# Altium schematic sheet Sheet1.SchDoc
size A4
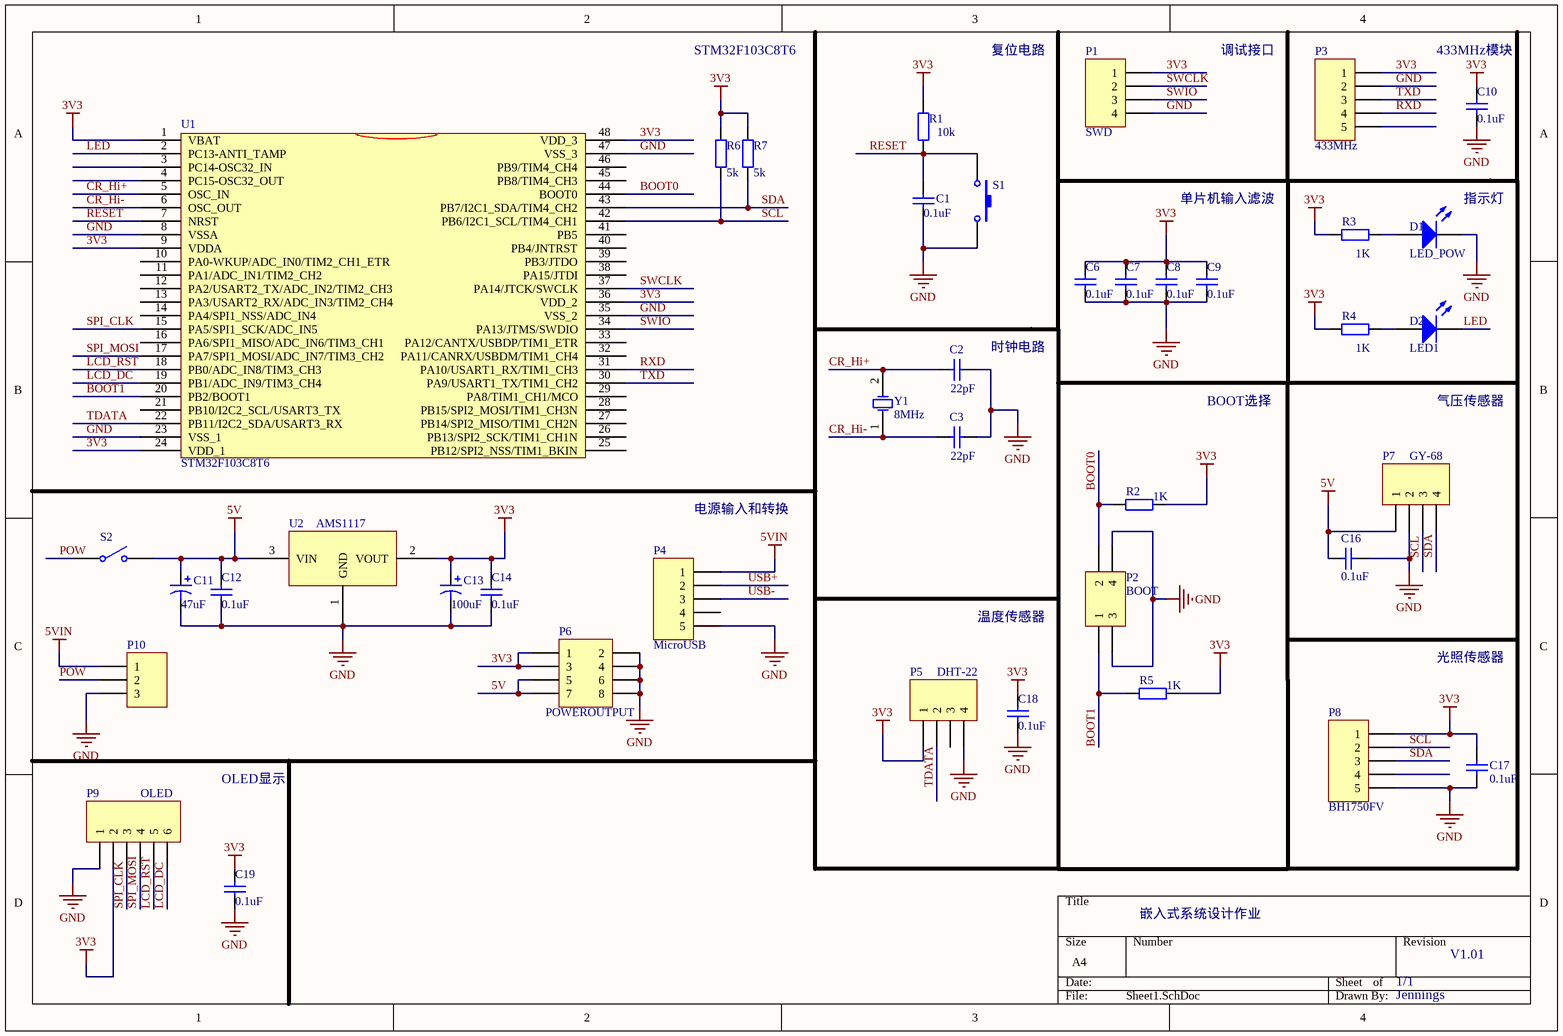
[diagram p0: Sheet1.SchDoc]

## Parts
C1  value 0.1uF  [0402]  (hidden comment: Cap)
C2  value 22pF  [0603-1]  (hidden comment: Cap)
C3  value 22pF  [0603-1]  (hidden comment: Cap)
C6  value 0.1uF  [0402]  (hidden comment: Cap)
C7  value 0.1uF  [0402]  (hidden comment: Cap)
C8  value 0.1uF  [0402]  (hidden comment: Cap)
C9  value 0.1uF  [0402]  (hidden comment: Cap)
C10  value 0.1uF  [0402]  (hidden comment: Cap)
C11  value 47uF  [CAP-7343]  (hidden comment: Cap Pol1)
C12  value 0.1uF  [0402]  (hidden comment: Cap)
C13  value 100uF  [CAP-6032]  (hidden comment: Cap Pol1)
C14  value 0.1uF  [0402]  (hidden comment: Cap)
C16  value 0.1uF  [0402]  (hidden comment: Cap)
C17  value 0.1uF  [0402]  (hidden comment: Cap)
C18  value 0.1uF  [0402]  (hidden comment: Cap)
C19  value 0.1uF  [0402]  (hidden comment: Cap)
D1  LED_POW  [0402]
D2  LED1  [0402]
P1  SWD  [HDR1X4]
P2  BOOT  [HDR2X2]
P3  433MHz  [HDR1X5]
P4  MicroUSB  [Micro_USB]
P5  DHT-22  [DHT22]
P6  POWEROUTPUT  [HDR2X4]
P7  GY-68  [BMP180MD]
P8  BH1750FV  [GY-30MD]
P9  OLED  [OLED0.96]
P10  Header 3  [HDR1X3]  (value not drawn)
R1  value 10k  [0603-1]  (hidden comment: Res2)
R2  value 1K  [0402]  (hidden comment: Res2)
R3  value 1K  [0402]  (hidden comment: Res2)
R4  value 1K  [0402]  (hidden comment: Res2)
R5  value 1K  [0402]  (hidden comment: Res2)
R6  value 5k  [0603-1]  (hidden comment: Res2)
R7  value 5k  [0603-1]  (hidden comment: Res2)
S1  SW-PB  [SW_PB4_A1]  (value not drawn)
S2  SW_POWER  [SW_Small]  (value not drawn)
U1  STM32F103C8T6  [LQFP48S]
U2  AMS1117  [SOT-223]
Y1  8MHz  [XTAL-8M]

## Nets
3V3: C6.2 C7.2 C8.2 C9.2 C10.2 C13.1 C14.2 C17.1 C18.2 C19.2 P1.1 P3.1 P5.1 P6.1 P6.3 P8.1 P9.2 R1.2 R2.2 R3.1 R4.1 R5.2 R6.2 R7.2 U1.1(VBAT) U1.9(VDDA) U1.24(VDD_1) U1.36(VDD_2) U1.48(VDD_3) U2.2(VOUT)
5V: C11.1 C12.2 C16.2 P6.5 P6.7 P7.1 S2.2(NO) U2.3(VIN)
5VIN: P4.1 P10.1
GND: C1.1 C2.2 C3.2 C6.1 C7.1 C8.1 C9.1 C10.1 C11.2 C12.1 C13.2 C14.1 C16.1 C17.2 C18.1 C19.1 D1.2(K) P1.4 P2.3 P2.4 P3.2 P4.5 P5.4 P6.2 P6.4 P6.6 P6.8 P7.2 P8.5 P9.1 P10.3 S1.2 U1.8(VSSA) U1.23(VSS_1) U1.35(VSS_2) U1.47(VSS_3) U2.1(GND)
BOOT0: P2.2 R2.1 U1.44(BOOT0)
BOOT1: P2.1 R5.1 U1.20(PB2/BOOT1)
CR_Hi+: C2.1 U1.5(OSC_IN) Y1.2(OSC2)
CR_Hi-: C3.1 U1.6(OSC_OUT) Y1.1(OSC1)
LCD_DC: P9.6 U1.19(PB1/ADC_IN9/TIM3_CH4)
LCD_RST: P9.5 U1.18(PB0/ADC_IN8/TIM3_CH3)
LED: D2.2(K) U1.2(PC13-ANTI_TAMP)
POW: P10.2 S2.1(COMMON)
RESET: C1.2 R1.1 S1.1 U1.7(NRST)
RXD: P3.4 U1.31(PA10/USART1_RX/TIM1_CH3)
SCL: P7.3 P8.2 R6.1 U1.42(PB6/I2C1_SCL/TIM4_CH1)
SDA: P7.4 P8.3 R7.1 U1.43(PB7/I2C1_SDA/TIM4_CH2)
SPI_CLK: P9.3 U1.15(PA5/SPI1_SCK/ADC_IN5)
SPI_MOSI: P9.4 U1.17(PA7/SPI1_MOSI/ADC_IN7/TIM3_CH2)
SWCLK: P1.2 U1.37(PA14/JTCK/SWCLK)
SWIO: P1.3 U1.34(PA13/JTMS/SWDIO)
TDATA: P5.2 U1.22(PB11/I2C2_SDA/USART3_RX)
TXD: P3.3 U1.30(PA9/USART1_TX/TIM1_CH2)
USB+: P4.2
USB-: P4.3
NetD1_1: D1.1(A) R3.2
NetD2_1: D2.1(A) R4.2

Not connected (* = marked no-connect by the designer): P3 5; P4 4; P5 3; P8 4; U1 3(PC14-OSC32_IN) 4(PC15-OSC32_OUT) 10(PA0-WKUP/ADC_IN0/TIM2_CH1_ETR) 11(PA1/ADC_IN1/TIM2_CH2) 12(PA2/USART2_TX/ADC_IN2/TIM2_CH3) 13(PA3/USART2_RX/ADC_IN3/TIM2_CH4) 14(PA4/SPI1_NSS/ADC_IN4) 16(PA6/SPI1_MISO/ADC_IN6/TIM3_CH1) 21(PB10/I2C2_SCL/USART3_TX) 25(PB12/SPI2_NSS/TIM1_BKIN) 26(PB13/SPI2_SCK/TIM1_CH1N) 27(PB14/SPI2_MISO/TIM1_CH2N) 28(PB15/SPI2_MOSI/TIM1_CH3N) 29(PA8/TIM1_CH1/MCO) 32(PA11/CANRX/USBDM/TIM1_CH4) 33(PA12/CANTX/USBDP/TIM1_ETR) 38(PA15/JTDI) 39(PB3/JTDO) 40(PB4/JNTRST) 41(PB5) 45(PB8/TIM4_CH3) 46(PB9/TIM4_CH4)

## Notes on the sheet
- STM32F103C8T6
- 复位电路
- 调试接口
- (near C10) 433MHz模块
- 单片机输入滤波
- (near D1) 指示灯
- (near C2) 时钟电路
- BOOT选择
- 气压传感器
- 电源输入和转换
- 温度传感器
- 光照传感器
- OLED显示
- 嵌入式系统设计作业
- 1/1
- V1.01
- Jennings

## Library data of the parts
C1-C3 C6-C10 C12 C14 C16-C19 = Cap: Capacitor; Published: 8-Jun-2000; LatestRevisionDate: 17-Jul-2002; LatestRevisionNote: Re-released for DXP Platform.; PackageReference: RAD-0.3; Publisher: Altium Limited
C11 C13 = Cap Pol1: Polarized Capacitor (Radial); Published: 8-Jun-2000; LatestRevisionDate: 17-Jul-2002; LatestRevisionNote: Re-released for DXP Platform.; PackageReference: RB7.6-15; Publisher: Altium Limited
D1 D2 = LED2: Typical RED, GREEN, YELLOW, AMBER GaAs LED; Published: 8-Jun-2000; LatestRevisionDate: 17-Jul-2002; LatestRevisionNote: Re-released for DXP Platform.; PackageDocument: Feb-2002; PackageReference: 3.2X1.6X1.1; Publisher: Altium Limited
P1 P5 P7 = Header 4: Header, 4-Pin; LatestRevisionDate: 17-Jul-2002; LatestRevisionNote: Re-released for DXP Platform.; Publisher: Altium Limited
P2 = Header 2X2: Header, 2-Pin, Dual row; LatestRevisionDate: 17-Jul-2002; LatestRevisionNote: Re-released for DXP Platform.; Publisher: Altium Limited
P3 P4 P8 = Header 5: Header, 5-Pin; LatestRevisionDate: 17-Jul-2002; LatestRevisionNote: Re-released for DXP Platform.; Publisher: Altium Limited
P6 = Header 4X2: Header, 4-Pin, Dual row; LatestRevisionDate: 17-Jul-2002; LatestRevisionNote: Re-released for DXP Platform.; Publisher: Altium Limited
P9 = Header 6: Header, 6-Pin; LatestRevisionDate: 17-Jul-2002; LatestRevisionNote: Re-released for DXP Platform.; Publisher: Altium Limited
P10 = Header 3: Header, 3-Pin; LatestRevisionDate: 17-Jul-2002; LatestRevisionNote: Re-released for DXP Platform.; Publisher: Altium Limited
R1-R7 = Res2: Resistor; Published: 8-Jun-2000; LatestRevisionDate: 17-Jul-2002; LatestRevisionNote: Re-released for DXP Platform.; PackageReference: AXIAL-0.4; Publisher: Altium Limited
S1 = SW-PB: Switch; Published: 24-Mar-1999; LatestRevisionDate: 17-Jul-2002; LatestRevisionNote: Re-released for DXP Platform.; PackageReference: SPST-2; Publisher: Altium Limited
S2 = SW-SPST: Single-Pole, Single-Throw Switch; Published: 24-Mar-1999; LatestRevisionDate: 17-Jul-2002; LatestRevisionNote: Re-released for DXP Platform.; PackageReference: SPST-2; Publisher: Altium Limited
U1 = STM32F103C6
Y1 = XTAL: Crystal Oscillator; Published: 8-Jun-2000; LatestRevisionDate: 17-Jul-2002; LatestRevisionNote: Re-released for DXP Platform.; PackageReference: R38; Publisher: Altium Limited